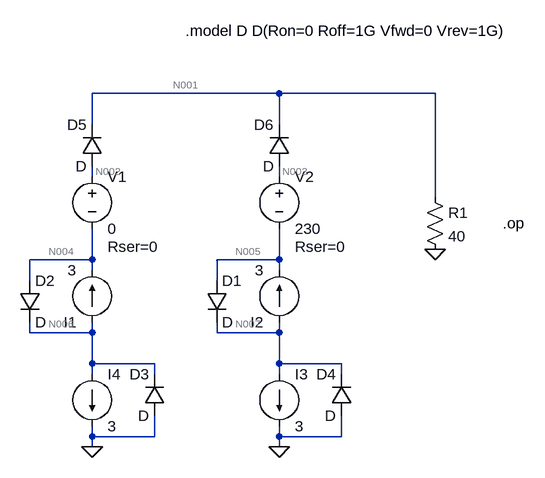
[diagram p0: schematic Generator-Test diode.asc]
Generator-Test diode.asc, the LTspice schematic file:
Version 4
SHEET 1 880 716
WIRE 384 0 96 0
WIRE 624 0 384 0
WIRE 96 48 96 0
WIRE 384 48 384 0
WIRE 96 128 96 112
WIRE 384 128 384 112
WIRE 624 160 624 0
WIRE 96 256 96 208
WIRE 96 256 0 256
WIRE 384 256 384 208
WIRE 384 256 288 256
WIRE 96 272 96 256
WIRE 384 272 384 256
WIRE 0 288 0 256
WIRE 288 288 288 256
WIRE 0 368 0 352
WIRE 96 368 96 352
WIRE 96 368 0 368
WIRE 288 368 288 352
WIRE 384 368 384 352
WIRE 384 368 288 368
WIRE 96 416 96 368
WIRE 192 416 96 416
WIRE 384 416 384 368
WIRE 480 416 384 416
WIRE 96 432 96 416
WIRE 192 432 192 416
WIRE 384 432 384 416
WIRE 480 432 480 416
WIRE 96 528 96 512
WIRE 192 528 192 496
WIRE 192 528 96 528
WIRE 384 528 384 512
WIRE 480 528 480 496
WIRE 480 528 384 528
WIRE 96 544 96 528
WIRE 384 544 384 528
FLAG 96 544 0
FLAG 384 544 0
FLAG 624 240 0
DATAFLAG 96 0 ""
SYMBOL voltage 96 112 R0
WINDOW 123 0 0 Left 0
WINDOW 39 24 124 Left 2
SYMATTR InstName V1
SYMATTR Value 0
SYMATTR SpiceLine Rser=0
SYMBOL voltage 384 112 R0
WINDOW 123 0 0 Left 0
WINDOW 39 24 124 Left 2
SYMATTR InstName V2
SYMATTR Value 230
SYMATTR SpiceLine Rser=0
SYMBOL current 96 352 R180
WINDOW 123 0 0 Left 0
WINDOW 39 0 0 Left 0
SYMATTR InstName I1
SYMATTR Value 3
SYMBOL current 384 352 R180
WINDOW 123 0 0 Left 0
WINDOW 39 0 0 Left 0
SYMATTR InstName I2
SYMATTR Value 3
SYMBOL diode 272 288 R0
SYMATTR InstName D1
SYMBOL diode -16 288 R0
SYMATTR InstName D2
SYMBOL res 608 144 R0
SYMATTR InstName R1
SYMATTR Value 40
SYMBOL current 384 432 R0
WINDOW 123 0 0 Left 0
WINDOW 39 0 0 Left 0
SYMATTR InstName I3
SYMATTR Value 3
SYMBOL current 96 432 R0
WINDOW 123 0 0 Left 0
WINDOW 39 0 0 Left 0
SYMATTR InstName I4
SYMATTR Value 3
SYMBOL diode 208 496 R180
WINDOW 0 24 64 Left 2
WINDOW 3 24 0 Left 2
SYMATTR InstName D3
SYMBOL diode 496 496 R180
WINDOW 0 24 64 Left 2
WINDOW 3 24 0 Left 2
SYMATTR InstName D4
SYMBOL diode 112 112 R180
WINDOW 0 24 64 Left 2
WINDOW 3 24 0 Left 2
SYMATTR InstName D5
SYMBOL diode 400 112 R180
WINDOW 0 24 64 Left 2
WINDOW 3 24 0 Left 2
SYMATTR InstName D6
TEXT 728 200 Left 2 !.op
TEXT 240 -96 Left 2 !.model D D(Ron=0 Roff=1G Vfwd=0 Vrev=1G)

The netlist it stands for:
* Generator-Test diode.asc
V1 N002 N004 0 Rser=0
V2 N003 N005 230 Rser=0
I1 N006 N004 3
I2 N007 N005 3
D1 N005 N007 D
D2 N004 N006 D
R1 N001 0 40
I3 N007 0 3
I4 N006 0 3
D3 0 N006 D
D4 0 N007 D
D5 N002 N001 D
D6 N003 N001 D
.model D D
.lib standard.dio
.op
.model D D(Ron=0 Roff=1G Vfwd=0 Vrev=1G)
.backanno
.end

* Results of the author's LTspice run, read from the files saved beside the schematic
* Operating Point:
*   V(n002) = 240 pV
*   V(n004) = 240 pV
*   V(n003) = 120 V
*   V(n005) = -110 V
*   V(n006) = -3 mV
*   V(n007) = -6 mV
*   V(n001) = 120 V
*   I(D6) = 3 A
*   I(D5) = -120 nA
*   I(D4) = 6 A
*   I(D3) = 3 A
*   I(D2) = 3 A
*   I(D1) = -110 nA
*   I(I4) = 3 A
*   I(I3) = 3 A
*   I(I2) = 3 A
*   I(I1) = 3 A
*   I(R1) = 3 A
*   I(V2) = -3 A
*   I(V1) = 120 nA